# EAGLE design RaspiOmix (EAGLE 7.2.0)
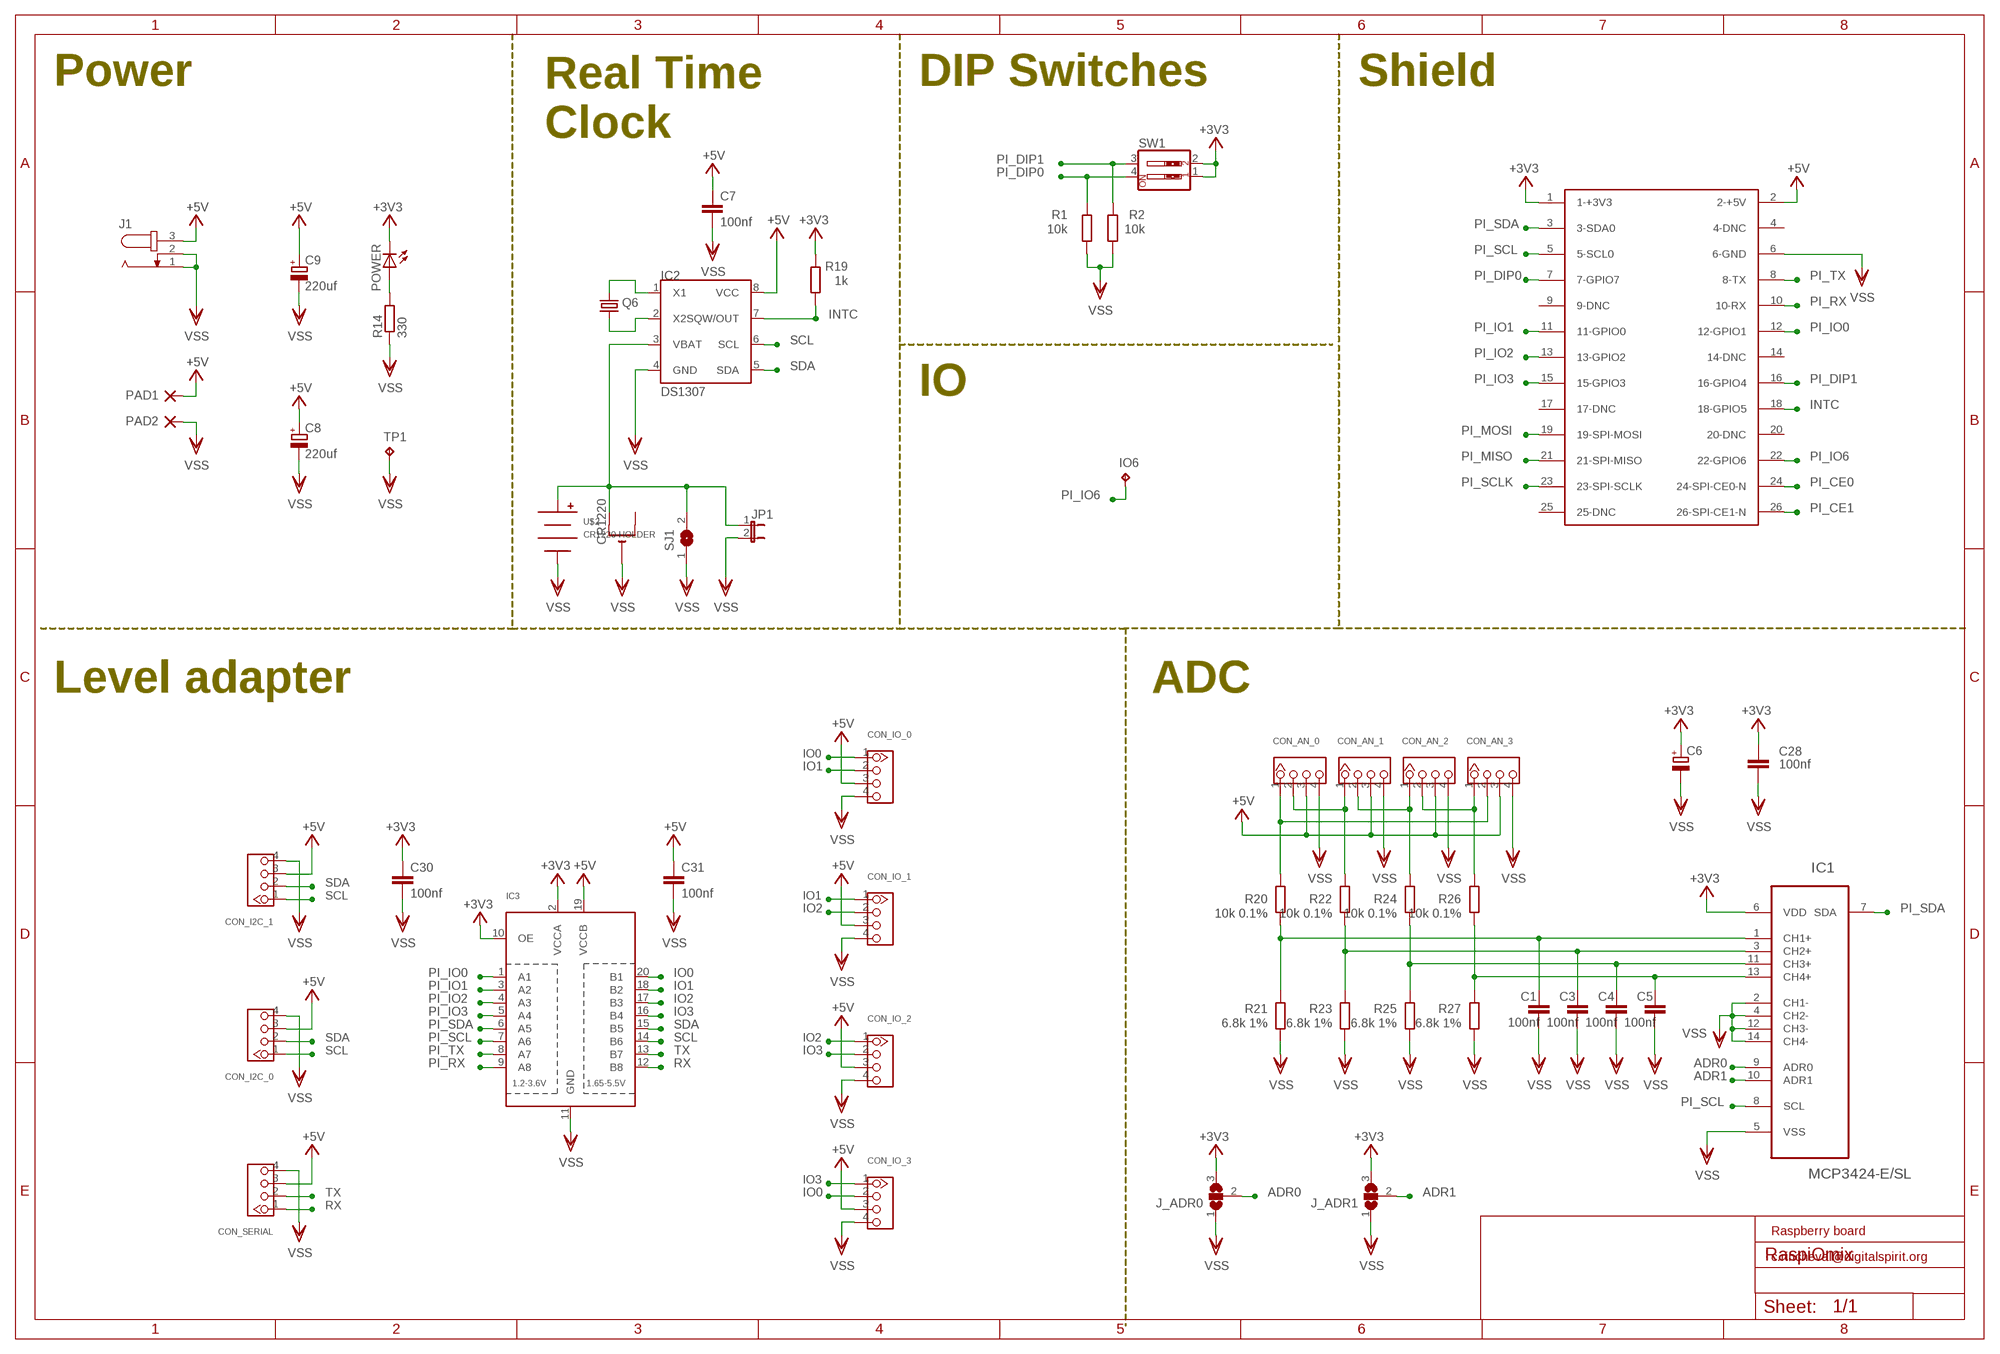
[diagram p0: schematic, sheet 1]

## Parts
C1  100nf  C-EUC0805  [C0805]
C3  100nf  C-EUC0805  [C0805]
C4  100nf  C-EUC0805  [C0805]
C5  100nf  C-EUC0805  [C0805]
C6  CPOL-EUB/3528-21R  [B/3528-21R]
C7  100nf  C-EUC0805  [C0805]
C8  220uf  CPOL-EUD  [PANASONIC_D]
C9  220uf  CPOL-EUD  [PANASONIC_D]
C28  100nf  C-EUC0805  [C0805]
C30  100nf  C-EUC0805  [C0805]
C31  100nf  C-EUC0805  [C0805]
CON_AN_0  TWIG-4P-2.0'90D'  [4P-2.0-90D]
CON_AN_1  TWIG-4P-2.0'90D'  [4P-2.0-90D]
CON_AN_2  TWIG-4P-2.0'90D'  [4P-2.0-90D]
CON_AN_3  TWIG-4P-2.0'90D'  [4P-2.0-90D]
CON_I2C_0  TWIG-4P-2.0'90D'  [4P-2.0-90D]
CON_I2C_1  TWIG-4P-2.0'90D'  [4P-2.0-90D]
CON_IO_0  TWIG-4P-2.0'90D'  [4P-2.0-90D]
CON_IO_1  TWIG-4P-2.0'90D'  [4P-2.0-90D]
CON_IO_2  TWIG-4P-2.0'90D'  [4P-2.0-90D]
CON_IO_3  TWIG-4P-2.0'90D'  [4P-2.0-90D]
CON_SERIAL  TWIG-4P-2.0'90D'  [4P-2.0-90D]
CR1220  CR1220THM  [CR1220-THM]
IC1  MCP3424-E/SL  [SOIC-14]
IC2  DS1307  [SOIC-8]
IC3  TXB0108PWR  [TSSOP20]
IO6  TPPAD1-13  [P1-13]
J1  JACK-PLUG0  [SPC4077]
J_ADR0  SJ2W  [SJ_2]
J_ADR1  SJ2W  [SJ_2]
JP1  JP1E  [JP1]
PAD1  WIREPAD3,17/1,3  [3,17/1,3]
PAD2  WIREPAD3,17/1,3  [3,17/1,3]
POWER  LEDCHIPLED_0805  [CHIPLED_0805]
Q6  CRYSTALTC26H  [TC26H]
R1  10k  R-EU_M0805  [M0805]
R2  10k  R-EU_M0805  [M0805]
R14  330  R-EU_M0805  [M0805]
R19  1k  R-EU_M0805  [M0805]
R20  10k 0.1%  R-EU_M0805  [M0805]
R21  6.8k 1%  R-EU_M0805  [M0805]
R22  10k 0.1%  R-EU_M0805  [M0805]
R23  6.8k 1%  R-EU_M0805  [M0805]
R24  10k 0.1%  R-EU_M0805  [M0805]
R25  6.8k 1%  R-EU_M0805  [M0805]
R26  10k 0.1%  R-EU_M0805  [M0805]
R27  6.8k 1%  R-EU_M0805  [M0805]
SJ1  SJ  [SJ]
SW1  SW_DIP-2  [EDG-02]
TP1  TPPAD1-13  [P1-13]
U$2  CR1220-HOLDER  [HARWIN-CR1220]
U$3  RASPBERRY-PILIGHT-HOLE  [RASPBERRY-PI-LIGHT-HOLE]

## Nets
+3V3: C6.+ C28.2 C30.1 IC1.6(VDD) IC3.2(VCCA) IC3.10(OE) J_ADR0.3 J_ADR1.3 POWER.C R19.2 SW1.1 SW1.2 U$3.1(1-+3V3)
+5V: C7.1 C8.+ C9.+ C31.1 CON_AN_0.3 CON_AN_1.3 CON_AN_2.3 CON_AN_3.3 CON_I2C_0.3 CON_I2C_1.3 CON_IO_0.3 CON_IO_1.3 CON_IO_2.3 CON_IO_3.3 CON_SERIAL.3 IC2.8(VCC) IC3.19(VCCB) J1.3 PAD1.1(P) U$3.2(2-+5V)
ADR0: IC1.9(ADR0) J_ADR0.2
ADR1: IC1.10(ADR1) J_ADR1.2
AN0: CON_AN_0.1 CON_AN_3.2 R20.2
AN1: CON_AN_0.2 CON_AN_1.1 R22.2
AN2: CON_AN_1.2 CON_AN_2.1 R24.2
AN3: CON_AN_2.2 CON_AN_3.1 R26.2
INTC: IC2.7(SQW/OUT) R19.1 U$3.18(18-GPIO5)
IO0: CON_IO_0.1 CON_IO_3.2 IC3.20(B1)
IO1: CON_IO_0.2 CON_IO_1.1 IC3.18(B2)
IO2: CON_IO_1.2 CON_IO_2.1 IC3.17(B3)
IO3: CON_IO_2.2 CON_IO_3.1 IC3.16(B4)
N$4: C5.1 IC1.13(CH4+) R26.1 R27.2
N$5: C4.1 IC1.11(CH3+) R24.1 R25.2
N$6: C3.1 IC1.3(CH2+) R22.1 R23.2
N$7: C1.1 IC1.1(CH1+) R20.1 R21.2
N$33: IC2.1(X1) Q6.1
N$34: IC2.2(X2) Q6.2
N$39: POWER.A R14.2
N$58: CR1220.+1(+) IC2.3(VBAT) JP1.1 SJ1.2 U$2.POS
PI_CE0: U$3.24(24-SPI-CE0-N)
PI_CE1: U$3.26(26-SPI-CE1-N)
PI_DIP0: R1.2 SW1.4 U$3.7(7-GPIO7)
PI_DIP1: R2.2 SW1.3 U$3.16(16-GPIO4)
PI_IO0: IC3.1(A1) U$3.12(12-GPIO1)
PI_IO1: IC3.3(A2) U$3.11(11-GPIO0)
PI_IO2: IC3.4(A3) U$3.13(13-GPIO2)
PI_IO3: IC3.5(A4) U$3.15(15-GPIO3)
PI_IO6: IO6.TP U$3.22(22-GPIO6)
PI_MISO: U$3.21(21-SPI-MISO)
PI_MOSI: U$3.19(19-SPI-MOSI)
PI_RX: IC3.9(A8) U$3.10(10-RX)
PI_SCL: IC1.8(SCL) IC3.7(A6) U$3.5(5-SCL0)
PI_SCLK: U$3.23(23-SPI-SCLK)
PI_SDA: IC1.7(SDA) IC3.6(A5) U$3.3(3-SDA0)
PI_TX: IC3.8(A7) U$3.8(8-TX)
RX: CON_SERIAL.1 IC3.12(B8)
SCL: CON_I2C_0.1 CON_I2C_1.1 IC2.6(SCL) IC3.14(B6)
SDA: CON_I2C_0.2 CON_I2C_1.2 IC2.5(SDA) IC3.15(B5)
TX: CON_SERIAL.2 IC3.13(B7)
VSS: C1.2 C3.2 C4.2 C5.2 C6.- C7.2 C8.- C9.- C28.1 C30.2 C31.2 CON_AN_0.4 CON_AN_1.4 CON_AN_2.4 CON_AN_3.4 CON_I2C_0.4 CON_I2C_1.4 CON_IO_0.4 CON_IO_1.4 CON_IO_2.4 CON_IO_3.4 CON_SERIAL.4 CR1220.- IC1.2(CH1-) IC1.4(CH2-) IC1.5(VSS) IC1.12(CH3-) IC1.14(CH4-) IC2.4(GND) IC3.11(GND) J1.1 J1.2 J_ADR0.1 J_ADR1.1 JP1.2 PAD2.1(P) R1.1 R2.1 R14.1 R21.1 R23.1 R25.1 R27.1 SJ1.1 TP1.TP U$2.NEG U$3.6(6-GND)
Unconnected: CR1220.+2(+1) U$3.4(4-DNC) U$3.9(9-DNC) U$3.14(14-DNC) U$3.17(17-DNC) U$3.20(20-DNC) U$3.25(25-DNC)

## Notes on the sheet
- Power | DIP Switches | Shield
- Real Time
  Clock
- IO
- Level adapter | ADC
- Raspberry board
- c.rincheval@digitalspirit.org

## Library data of the parts
C1 C3-C5 C7 C28 C30 C31 = rcl:C-EU: CAPACITOR, European symbol
C6 C8 C9 = rcl:CPOL-EU: POLARIZED CAPACITOR, European symbol
CON_AN_0 CON_AN_1-CON_AN_3 CON_I2C_0 CON_I2C_1 CON_IO_0 CON_IO_1-CON_IO_3 CON_SERIAL = Seeedstudio_Connector:TWIG-4P-2.0
CR1220 = adafruit:CR1220: CR1216/CR1220/CR1225 12mm 3V lithium coin cell Great for battery packup. Both SMT and THM holders. Note the THM package has the ground pads on both sides of the PCB so that the masks are the same - this reduces the cost
IC1 = eagleParts:MCP3424-E/SL
IC2 = eagleParts:DS1307: I2C Serial RTC w/56 bytes battery backed RAM
IC3 = adafruit:TXB0108PWR: 8-Bit Bi-Directional Level Shifter 1.2V-3.6V (VCCA) to 1.65V-5.5V (VCCB) bi-directional level shifter with auto direction sensing. Max data rate - VCCA 1.8V: 20Mbps (50ns), VCCA 3.3V: 100Mbps (10ns) Digikey: 296-21527-1-ND
IO6 TP1 = testpad:TP: Test pad
J1 = con-jack:JACK-PLUG: DC POWER JACK Power Jack, DC, Right Angle, Through Hole, Rated 5A at 16VDC, PC Terminals Distributor: Farnell (www.Farnell.de) Drawing: 84N1161.pdf / 84N1162.pdf Manufacturer: SPC Technology (www.spctechnology.com) Type: SPC4077 / SPC 4078; OC_FARNELL: unknown; OC_NEWARK: unknown
J_ADR0 J_ADR1 = jumper:SJ2W: SMD solder JUMPER
JP1 = jumper:JP1E: JUMPER
PAD1 PAD2 = wirepad:WIREPAD: Wire PAD connect wire on PCB
POWER = led:LED: LED OSRAM: - CHIPLED LG R971, LG N971, LY N971, LG Q971, LY Q971, LO R971, LY R971 LH N974, LH R974 LS Q976, LO Q976, LY Q976 LO Q996 - Hyper CHIPLED LW Q18S LB Q993, LB Q99A, LB R99A - SideLED LS A670, LO A670, LY A670, LG A670, LP A670 LB A673, LV A673, LT A673, LW A673 LH A674 LY A675 LS A676, LA A676, LO A676, LY A676, LW A676 LS A679, LY A679, LG A679 - Hyper Micro SIDELED® LS Y876, LA Y876, LO Y876, LY Y876 LT Y87S - SmartLED LW L88C, LW L88S LB L89C, LB L89S, LG L890 LS L89K, LO L89K, LY L89K LS L896, LA L896, LO L896, LY L896 - TOPLED LS T670, LO T670, LY T670, LG T670, LP T670 LSG T670, LSP T670, LSY T670, LOP T670, LYG T670 LG T671, LOG T671, LSG T671 LB T673, LV T673, LT T673, LW T673 LH T674 LS T676, LA T676, LO T676, LY T676, LB T676, LH T676, LSB T676, LW T676 LB T67C, LV T67C, LT T67C, LS T67K, LO T67K, LY T67K, LW E67C LS E67B, LA E67B, LO E67B, LY E67B, LB E67C, LV E67C, LT E67C LW T67C LS T679, LY T679, LG T679 LS T770, LO T770, LY T770, LG T770, LP T770 LB T773, LV T773, LT T773, LW T773 LH T774 LS E675, LA E675, LY E675, LS T675 LS T776, LA T776, LO T776, LY T776, LB T776 LHGB T686 LT T68C, LB T68C - Hyper Mini TOPLED® LB M676 - Mini TOPLED Santana® LG M470 LS M47K, LO M47K, LY M47K Source: http://www.osram.convergy.de LUXEON: - LUMILED® LXK2-PW12-R00, LXK2-PW12-S00, LXK2-PW14-U00, LXK2-PW14-V00 LXK2-PM12-R00, LXK2-PM12-S00, LXK2-PM14-U00 LXK2-PE12-Q00, LXK2-PE12-R00, LXK2-PE12-S00, LXK2-PE14-T00, LXK2-PE14-U00 LXK2-PB12-K00, LXK2-PB12-L00, LXK2-PB12-M00, LXK2-PB14-N00, LXK2-PB14-P00, LXK2-PB14-Q00 LXK2-PR12-L00, LXK2-PR12-M00, LXK2-PR14-Q00, LXK2-PR14-R00 LXK2-PD12-Q00, LXK2-PD12-R00, LXK2-PD12-S00 LXK2-PH12-R00, LXK2-PH12-S00 LXK2-PL12-P00, LXK2-PL12-Q00, LXK2-PL12-R00 Source: www.luxeon.com KINGBRIGHT: KA-3528ASYC Source: www.kingbright.com
Q6 = crystal:CRYSTAL: CRYSTAL; OC_FARNELL: unknown; OC_NEWARK: unknown
R1 R2 R14 R19-R27 = rcl:R-EU_: RESISTOR, European symbol
SJ1 = jumper:SJ: SMD solder JUMPER
SW1 = special:SW_DIP-2: DIP SWITCH
U$2 = battery-holder:CR1220-HOLDER
U$3 = RaspberryPi:RASPBERRY-PI: Raspberry Pi Board <http://www.raspberrypi.org/> Jacques Lagnel V1.0 (beta) 2012 Board dimension: Forum 3D model <http://www.raspberrypi.org/forum/general-discussion/mechanical-profile-3d-models?value=3d%20model&type=1&include=1&search=1&ret=all> The GPIO Connector (P1): http://elinux.org/RPi_Low-level_peripherals

## Board
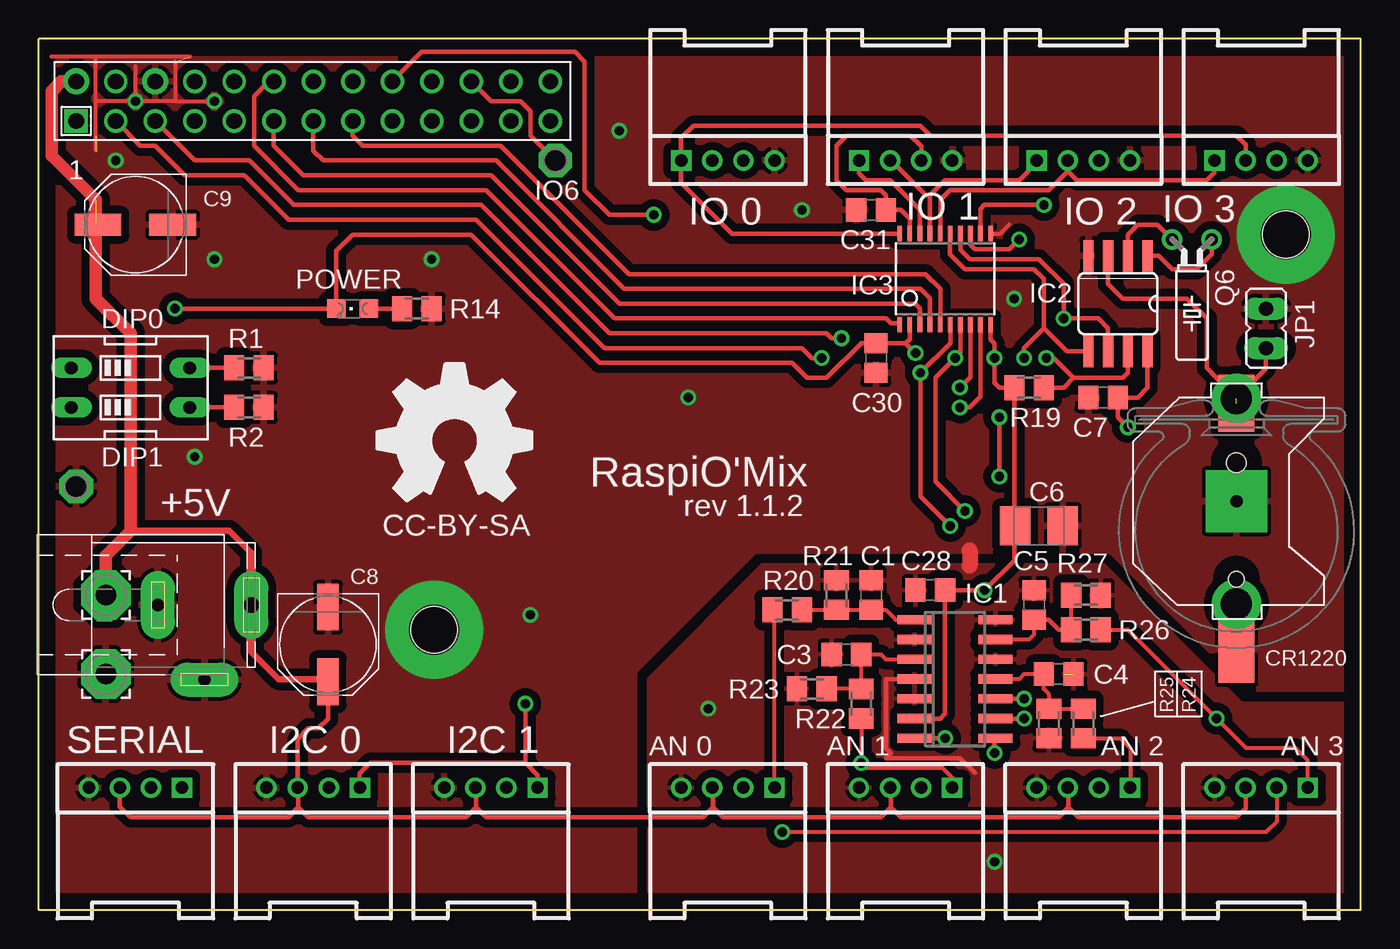
[diagram p1: board, top side]
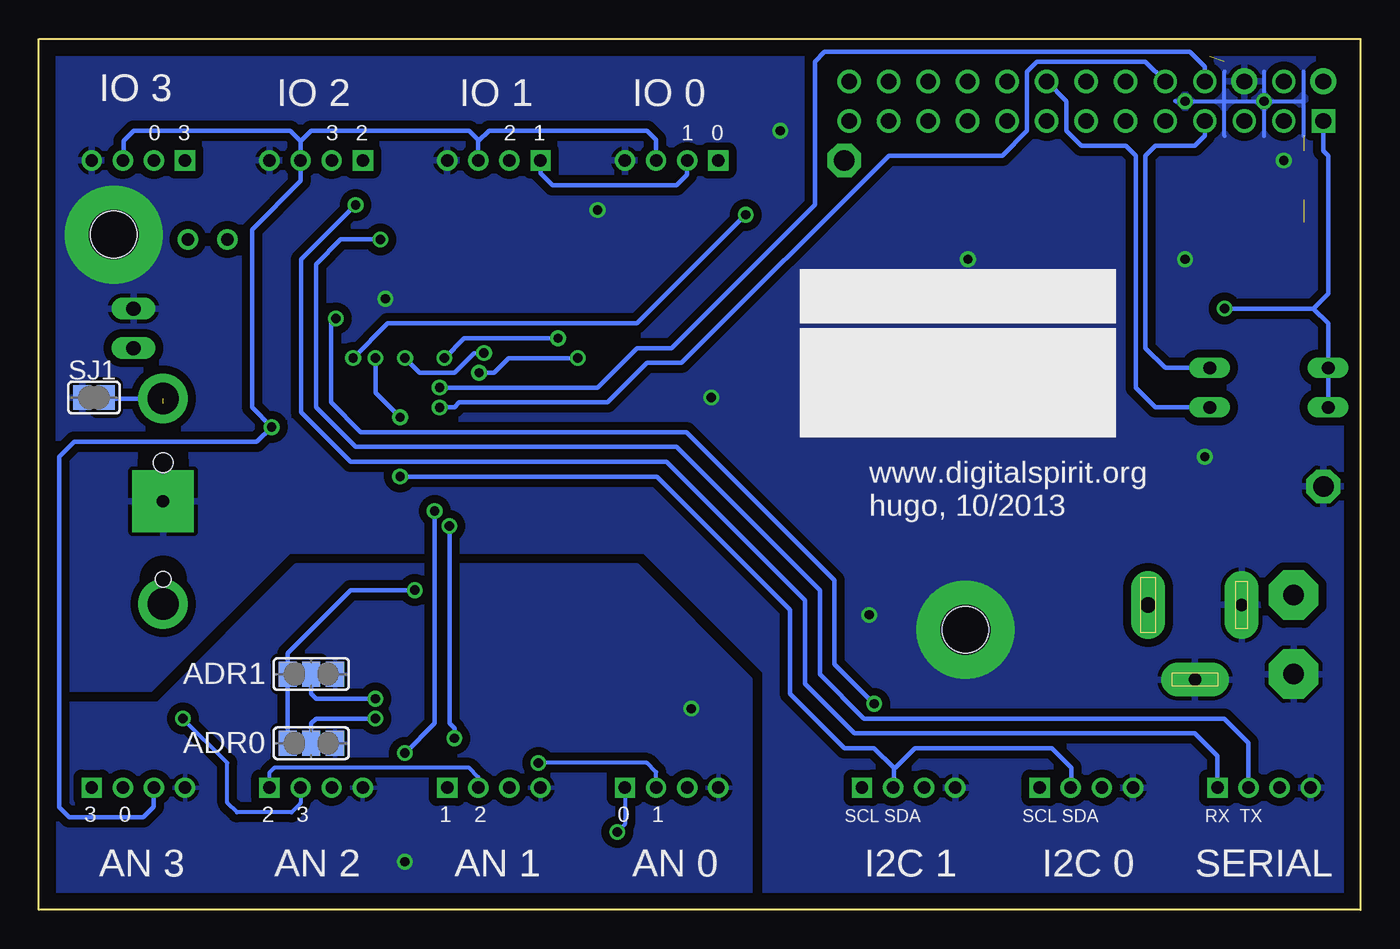
[diagram p2: board, bottom side, seen from below]

Size 85 x 56 mm. Coordinates in mm from the lower left corner, seen from the top.
Copper layers (1*16): Top 0.035mm / dielectric 1.5mm / Bottom 0.035mm
Design rules "default": minimum track width 10mil, minimum drill 24mil, track to track 8mil, track to pad 8mil, pad to pad 8mil, via to via 8mil, smd to smd 8mil, copper to edge 40mil, drill to drill 8mil, minimum pad ring 10mil, minimum via ring 8mil, stop-mask expansion 4mil, vias tented up to drill 0mil, thermal gap 10mil

### Footprints (pad centres in the part's own frame; a part is rotated, then mirrored left to right if it is on the bottom)
C0805 = smd 1.3 x 1.5: 1 -0.95,0; 2 0.95,0
B/3528-21R = smd 1.95 x 2.5: + 1.525,0; - -1.525,0
PANASONIC_D = smd 3 x 1.4: + 2.4,0; - -2.4,0
4P-2.0-90D = drill 0.8 pad 1.27 square: 1 -3,0 | drill 0.8 pad 1.27: 2 -1,0; 3 1,0; 4 3,0
CR1220-THM = drill 2 pad 3.175: +1 -6.604,0; +2 6.604,0 | drill 0.8 pad 3.962 square: - 0,0
SOIC-14 = smd 0.6 x 2.2: 1 -3.81,-2.6; 2 -2.54,-2.6; 3 -1.27,-2.6; 4 0,-2.6; 5 1.27,-2.6; 6 2.54,-2.6; 7 3.81,-2.6; 8 3.81,2.6; 9 2.54,2.6; 10 1.27,2.6; 11 0,2.6; 12 -1.27,2.6; 13 -2.54,2.6; 14 -3.81,2.6
SOIC-8 = smd 2.032 x 0.66: 1 -3.073,1.27; 2 -3.073,0; 3 -3.073,-1.27; 4 -3.073,-2.54; 5 3.073,-2.54; 6 3.073,-1.27; 7 3.073,0; 8 3.073,1.27
TSSOP20 = smd 0.305 x 0.991: 1 -2.925,-2.918; 2 -2.275,-2.918; 3 -1.625,-2.918; 4 -0.975,-2.918; 5 -0.325,-2.918; 6 0.325,-2.918; 7 0.975,-2.918; 8 1.625,-2.918; 9 2.275,-2.918; 10 2.925,-2.918; 11 2.925,2.918; 12 2.275,2.918; 13 1.625,2.918; 14 0.975,2.918; 15 0.325,2.918; 16 -0.325,2.918; 17 -0.975,2.918; 18 -1.625,2.918; 19 -2.275,2.918; 20 -2.925,2.918
P1-13 = drill 1.321 pad 2.159 octagon: TP 0,0
SPC4077 = drill 0.8 pad 2.184 long: 1 -3,0; 2 0,-4.8 | drill 1 pad 2.184 long: 3 3,0
SJ_2 = smd 1.168 x 1.6: 1 -1.524,0; 2 0,0; 3 1.524,0
JP1 = drill 0.914 long: 1 0,-1.27; 2 0,1.27
3,17/1,3 = drill 1.321 pad 3.175 octagon: 1 0,0
CHIPLED_0805 = smd 1.2 x 1.2: A 0,-1.05; C 0,1.05
TC26H = drill 0.813: 1 -1.27,0; 2 1.27,0
M0805 = smd 1.3 x 1.6: 1 -0.95,0; 2 0.95,0
SJ = smd 1.168 x 1.6: 1 -0.762,0; 2 0.762,0
EDG-02 = drill 0.813 long: 1 -1.27,-3.81; 2 1.27,-3.81; 3 1.27,3.81; 4 -1.27,3.81
HARWIN-CR1220 = smd 2.3 x 4.3: NEG 0,8.26 | smd 2.3 x 3.66: POS 0,-7.58 | hole 1: 0,3.75 | hole 1.25: 0,-3.75
RASPBERRY-PI-LIGHT-HOLE = drill 1 square: 1 -39.37,22.86 | drill 1 pad 1.676: 2 -39.37,25.4; 6 -34.29,25.4 | drill 1: 3 -36.83,22.86; 4 -36.83,25.4; 5 -34.29,22.86; 7 -31.75,22.86; 8 -31.75,25.4; 9 -29.21,22.86; 10 -29.21,25.4; 11 -26.67,22.86; 12 -26.67,25.4; 13 -24.13,22.86; 14 -24.13,25.4; 15 -21.59,22.86; 16 -21.59,25.4; 17 -19.05,22.86; 18 -19.05,25.4; 19 -16.51,22.86; 20 -16.51,25.4; 21 -13.97,22.86; 22 -13.97,25.4; 23 -11.43,22.86; 24 -11.43,25.4; 25 -8.89,22.86; 26 -8.89,25.4 | hole 3: -16.351,-9.842; 38.417,15.557

### Placement (x,y rotation side)
C1  53.52,20.24 90 top
C3  51.93,16.43 180 top
C4  65.58,15.16 0 top
C5  64,19.61 90 top
C6  64.31,24.69 180 top
C7  68.44,32.95 180 top
C8  18.59,17.07 270 top
C9  6.21,44.06 180 top
C28  57.33,20.56 0 top
C30  53.84,35.48 270 top
C31  53.52,45.01 180 top
CON_AN_0  44.31,7.86 180 top
CON_AN_1  55.74,7.86 180 top
CON_AN_2  67.17,7.86 180 top
CON_AN_3  78.6,7.86 180 top
CON_I2C_0  17.64,7.86 180 top
CON_I2C_1  29.07,7.86 180 top
CON_IO_0  44.31,48.18 0 top
CON_IO_1  55.74,48.18 0 top
CON_IO_2  67.17,48.18 0 top
CON_IO_3  78.6,48.18 0 top
CON_SERIAL  6.21,7.86 180 top
CR1220  77.01,26.28 270 top
IC1  58.92,14.85 270 top
IC2  70.03,38.98 270 top
IC3  58.28,40.56 0 top
IO6  33.2,48.18 0 top
J1  10.66,19.61 0 top
J_ADR0  67.49,10.72 180 bottom
J_ADR1  67.49,15.16 180 bottom
JP1  78.92,37.39 0 top
PAD1  4.31,20.24 0 top
PAD2  4.31,15.16 0 top
POWER  20.18,38.66 90 top
Q6  74.16,43.1 180 top
R1  13.51,34.85 180 top
R2  13.51,32.31 180 top
R14  24.31,38.66 180 top
R19  63.68,33.58 180 top
R20  48.12,19.29 180 top
R21  51.3,20.24 270 top
R22  52.88,13.26 270 top
R23  49.71,14.21 0 top
R24  67.17,11.99 270 top
R25  64.95,11.99 90 top
R26  67.33,18.02 0 top
R27  67.33,20.24 180 top
SJ1  81.46,32.95 0 bottom
SW1  5.89,33.58 270 top
TP1  2.4,27.23 0 top
U$1  [OSHW_FILLX350_NOTEXT]  21.77,26.28 0 top
U$2  77.01,25.01 180 top
U$3  41.77,27.86 0 top

### Tracks (layer width: path | path; a pad name or v marks a point on that pad's centre or on a via)
+3V3  (via drill 0.6, 0.6 pad 1.02)
  Top 0.254: C6.+ 62.73,24.69
  Top 0.305: v8.75,38.66 POWER.C 19.13,42.37 20.18,43.42 27.8,43.42 36.06,35.17 48.44,35.17 49.39,34.21 50.66,34.21 52.88,36.44 C30.1 55.74,36.43 55.74,36.44 | IC1.6 57.96,12.31 58.28,12.62 C28.2 v60.82,20.56 62.73,22.47 62.73,24.69 62.73,32.95 R19.2 61.77,33.58 61.46,33.9 v61.46,35.48 61.46,36.44 61.21,36.69 IC3.10 | IC3.2 56.01,36.7 55.74,36.44 | 55.74,36.44 v56.38,35.8
  Bottom 0.305: SW1.2 SW1.1 2.08,37.71 3.04,38.66 | v56.38,35.8 57.01,35.8 58.28,34.53 60.5,34.53 v61.46,35.48 | v8.75,38.66 3.04,38.66 | 3.04,38.66 2.08,39.61 2.08,48.5 2.4,48.82 U$3.1 | J_ADR0.3 J_ADR1.3 69.01,16.5 64.95,20.56 v60.82,20.56
+5V  (via drill 0.6 pad 1.02)  (1 unrouted)
  Top 0.305: IC2.8 71.3,35.58 71.3,33.58 70.66,32.95 C7.1 69.39,33.26 69.39,31.67 v70.03,31.04 | IC3.19 56.01,44.43 55.42,45.01 C31.1 | C31.1 | CON_SERIAL.3 5.21,6.64 5.89,5.96 16.05,5.96 16.69,6.59 | CON_AN_0.3 43.36,7.86 43.36,6.59 | 43.36,6.59 42.72,5.96 28.75,5.96 28.12,6.59 | 43.36,6.59 43.99,5.96 54.15,5.96 54.79,6.59 | 16.69,6.59 16.69,7.86 CON_I2C_0.3 16.64,10.99 17.32,11.67 17.96,11.67 18.59,12.31 18.59,14.53 18.45,14.67 18.22,14.67 | 16.69,6.59 17.32,5.96 27.48,5.96 28.12,6.59 | 28.12,6.59 28.12,7.81 CON_I2C_1.3 | CON_AN_1.3 54.79,7.81 54.79,6.59 | 54.79,6.59 55.42,5.96 65.58,5.96 66.22,6.59 | 66.22,6.59 66.22,7.81 CON_AN_2.3 | CON_AN_3.3 77.6,6.54 77.01,5.96 66.85,5.96 66.22,6.59 | C31.1 54.47,45.96 54.15,46.28 51.93,46.28 51.3,46.91 51.3,49.14 51.93,49.77 56.06,49.77 56.74,49.09 CON_IO_1.3
  Top 0.406: 5.89,24.37 12.24,24.37 13.66,22.96 J1.3 13.66,16.61 15.42,14.85 18.22,14.85 18.22,14.67 C8.+ 18.64,14.67
  Top 0.61: 3.67,44.2 C9.+ 3.67,43.92
  Top 0.813: PAD1.1 4.31,22.78 5.89,24.37 5.89,37.07 3.67,39.29 3.67,45.64 0.81,48.5 0.81,52.63 1.45,53.27 U$3.2
  Bottom 0.305: CON_IO_3.3 79.55,48.18 79.55,49.45 78.92,50.09 68.85,50.09 68.17,49.41 | CON_IO_0.3 45.31,49.5 45.9,50.09 56.06,50.09 56.74,49.41 CON_IO_1.3 56.74,49.5 57.33,50.09 67.49,50.09 68.17,49.41 | 68.17,49.41 CON_IO_2.3 68.17,46.87 71.3,43.74 71.3,32.31 v70.03,31.04 70.98,30.09 82.73,30.09 83.68,29.13 83.68,6.59 83.05,5.96 78.28,5.96 77.6,6.64 CON_AN_3.3 77.6,7.91
ADR0  (via drill 0.6 pad 1.02)
  Top 0.305: IC1.9 v63.36,12.31
  Bottom 0.102: J_ADR0.2 69.08,10.72
  Bottom 0.305: v63.36,12.31 67.17,12.31 67.49,11.99 J_ADR0.2
ADR1  (via drill 0.6 pad 1.02)
  Top 0.305: IC1.10 v63.36,13.58
  Bottom 0.102: J_ADR1.2 69.08,15.16
  Bottom 0.305: v63.36,13.58 67.17,13.58 67.49,13.89 J_ADR1.2
AN0  (via drill 0.6)
  Top 0.254: CON_AN_0.1 47.31,19.15 R20.2 | CON_AN_3.2 79.6,5.69 78.92,5 v47.8,5
  Bottom 0.254: CON_AN_0.1 47.31,5.5 v47.8,5
AN1  (via drill 0.6)
  Top 0.254: CON_AN_1.1 58.74,8.51 58.12,9.13 53.2,9.13 v52.88,9.45 R22.2
  Bottom 0.254: CON_AN_0.2 45.31,8.86 45.9,9.45 v52.88,9.45
AN2
  Top 0.254: R24.2 69.55,11.04 70.19,10.4 70.19,7.88 CON_AN_2.1
  Bottom 0.254: CON_AN_1.2 56.74,8.54 57.33,9.13 69.87,9.13 70.19,8.81 70.19,7.88 CON_AN_2.1
AN3  (via drill 0.6)
  Top 0.254: R26.2 70.03,18.02 v75.74,12.31 77.65,10.4 80.82,10.4 81.6,9.62 CON_AN_3.1
  Bottom 0.254: CON_AN_2.2 68.17,6.86 68.76,6.27 72.25,6.27 72.89,6.91 72.89,9.45 v75.74,12.31
INTC  (via drill 0.6, 0.6 pad 1.02)
  Top 0.305: U$3.18 24.63,55.17 34.47,55.17 35.1,54.53 35.1,46.28 36.69,44.69 v39.55,44.69 | IC2.7 70.03,34.53 69.71,34.21 66.53,34.21 | R19.1 65.9,33.58 66.53,34.21 | 66.53,34.21 65.27,35.48 v64.79,35.48
  Bottom 0.305: v39.55,44.69 46.53,37.71 62.57,37.71 v64.79,35.48
IO0
  Top 0.305: IC3.20 44.57,43.48 41.31,46.74 CON_IO_0.1 41.31,49.63 42.09,50.41 56.69,50.41 57.33,49.77 77.01,49.77 77.6,49.18 CON_IO_3.2
IO1
  Top 0.305: IC3.18 56.66,45.03 54.77,46.91 53.2,46.91 52.74,47.38 CON_IO_1.1
  Bottom 0.305: CON_IO_0.2 43.31,47.28 43.99,46.6 51.96,46.6 52.74,47.38 CON_IO_1.1
IO2
  Top 0.305: IC3.17 57.31,45.94 | 57.31,45.94 58.28,46.91 63.04,46.91 64.31,48.18 CON_IO_2.1 | CON_IO_1.2 54.79,48.18 57.03,45.94 57.31,45.94
IO3
  Top 0.305: IC3.16 57.96,43.49 57.96,45.64 58.6,46.28 64.95,46.28 66.17,47.5 | CON_IO_3.1 75.6,47.41 75.11,46.91 66.76,46.91 66.17,47.5 | CON_IO_2.2 66.17,47.5
N$4
  Top 0.254: R27.2 66.38,18.34 | 66.38,18.34 66.22,18.65 | 66.22,18.34 66.22,18.65 | 66.22,18.65 R26.1 66.38,18.34 | C5.1 64,17.7 63.68,17.39 IC1.13
  Top 0.305: C5.1 64.94,18.66 65.58,18.02 R26.1
N$5
  Top 0.254: IC1.11 63.04,14.85 63.36,15.16 C4.1 64.63,14.21 64.95,13.89 R25.2 R24.1
N$6
  Top 0.254: R23.2 R22.1 C3.1 54.15,16.43 54.47,16.12 IC1.3
N$7
  Top 0.254: R20.1 50.98,19.29 R21.2 C1.1 54.47,19.29 55.11,18.66 IC1.1
  Top 0.305: IC1.1 56.38,18.66 56.37,18.66
N$33
  Top 0.305: IC2.1 72.03,42.05 72.89,41.2 74.47,41.2 75.43,42.15 Q6.1
N$34
  Top 0.305: Q6.2 71.93,44.06 70.66,44.06 70.03,43.42 IC2.2
N$39
  Top 0.305: POWER.A R14.2
N$58  (1 unrouted)
  Top 0.305: IC2.3 68.76,40.25 69.71,39.29 73.84,39.29 75.11,38.02 75.11,34.85 CR1220.+1 78.92,34.79 JP1.1
  Bottom 0.305: CR1220.+1 80.63,32.88 SJ1.2
PI_DIP0
  Top 0.305: R1.2 SW1.4
  Bottom 0.305: SW1.4 R1.2 13.83,36.12 13.83,48.5 13.2,49.14 10.66,49.14 10.02,49.77 U$3.7
PI_DIP1
  Top 0.305: R2.2 SW1.3
  Bottom 0.305: U$3.16 18.91,51.99 18.91,50.09 17.96,49.14 15.1,49.14 14.47,48.5 14.47,33.58 13.2,32.31 SW1.3
PI_IO0
  Top 0.305: IC3.1 55.3,37.71 54.79,37.71 54.47,38.02 37.01,38.02 28.75,46.28 16.69,46.28 13.83,49.14 13.83,52.31 14.78,53.27 U$3.12
PI_IO1
  Top 0.305: U$3.11 15.1,49.14 17.01,47.23 29.07,47.23 37.33,38.98 56.38,38.98 56.65,38.7 56.65,37.72 IC3.3
PI_IO2
  Top 0.305: IC3.4 57.31,39.32 56.69,39.93 37.64,39.93 29.39,48.18 18.28,48.18 17.64,48.82 U$3.13
PI_IO3
  Top 0.305: U$3.15 20.18,49.77 20.82,49.14 29.71,49.14 37.96,40.88 57.01,40.88 57.96,39.93 57.96,37.65 IC3.5
PI_IO6
  Top 0.305: U$3.22 29.07,51.99 30.98,51.99 31.61,51.36 31.61,49.77 IO6.TP
PI_RX  (via drill 0.6)
  Top 0.305: IC3.9 60.56,33 59.87,32.31 v59.23,32.31
  Bottom 0.305: v59.23,32.31 58.28,32.31 57.96,32.63 48.44,32.63 45.9,35.17 43.68,35.17 30.34,48.5 23.04,48.5 21.45,50.09 21.45,53.9 20.82,54.53 13.83,54.53 U$3.10
PI_SCL  (via drill 0.6)
  Top 0.305: U$3.5 10.02,48.18 13.51,48.18 16.37,45.33 28.44,45.33 36.69,37.07 50.66,37.07 50.98,36.75 v51.61,36.75 | IC3.7 59.26,35.82 v58.92,35.48 57.65,34.21 57.65,27.55 v59.55,25.64 | IC1.8 61.46,11.04 v61.46,10.08
  Bottom 0.305: v61.46,10.08 59.55,11.99 v59.55,25.64 | v51.61,36.75 57.65,36.75 v58.92,35.48
PI_SDA  (via drill 0.6)
  Top 0.305: U$3.3 6.53,49.14 7.48,49.14 9.39,47.23 13.2,47.23 16.05,44.38 28.12,44.38 36.37,36.12 49.07,36.12 49.71,35.48 v50.34,35.48 | v58.6,24.69 56.69,26.59 v56.69,34.53 58.61,36.45 IC3.6 | IC1.7 v58.28,11.04
  Bottom 0.305: v58.6,24.69 58.6,11.99 58.28,11.67 v58.28,11.04 | v50.34,35.48 54.79,35.48 55.74,34.53 v56.69,34.53
PI_TX  (via drill 0.6)
  Top 0.305: IC3.8 59.91,34.25 v59.23,33.58
  Bottom 0.305: U$3.8 10.02,54.22 10.97,55.17 34.47,55.17 35.1,54.53 35.1,45.33 44.31,36.12 46.53,36.12 49.07,33.58 v59.23,33.58
RX  (via drill 0.6)
  Top 0.305: IC3.12 60.56,45.06 60.82,45.33 v64.63,45.33
  Bottom 0.305: v64.63,45.33 68.12,41.83 68.12,31.99 64.95,28.82 44.63,28.82 35.74,19.93 35.74,14.53 32.56,11.35 10.66,11.35 9.21,9.91 CON_SERIAL.1
SCL  (via drill 0.6)
  Top 0.305: IC3.14 59.26,42.45 59.87,41.83 64.31,41.83 65.9,40.25 v65.9,38.02 68.12,38.02 68.76,37.39 IC2.6 | CON_I2C_0.1 20.64,8.8 21.29,9.45 31.29,9.45 | CON_I2C_1.1 32.07,8.67 31.29,9.45 | 31.29,9.45 v31.29,13.26
  Bottom 0.305: v31.29,13.26 33.83,15.8 33.83,21.2 43.36,30.72 64.31,30.72 66.22,32.63 66.22,37.71 v65.9,38.02
SDA  (via drill 0.6 pad 1.02)
  Top 0.305: 64.63,37.39 64.63,40.56 64,41.2 59.55,41.2 58.6,42.15 58.6,43.47 IC3.15 | IC2.5 66.12,35.9 64.63,37.39 | 64.63,37.39 63.36,36.12 v63.36,35.48 | v61.77,31.67 v61.77,27.86
  Bottom 0.305: v61.77,27.86 45.26,27.86 36.69,19.29 36.69,13.89 33.2,10.4 31.29,10.4 30.02,9.13 | v63.36,35.48 63.36,33.26 v61.77,31.67 | CON_I2C_0.2 18.59,7.86 18.59,9.13 19.86,10.4 28.66,10.4 29.93,9.13 30.02,9.13 | CON_I2C_1.2 30.02,7.86 30.02,9.13
TX  (via drill 0.6 pad 1.02)
  Top 0.305: IC3.13 59.91,42.75 60.19,42.47 62.41,42.47 v63.04,43.1
  Bottom 0.305: v63.04,43.1 65.58,43.1 67.17,41.52 67.17,32.31 64.63,29.77 43.99,29.77 34.79,20.56 34.79,15.16 31.93,12.31 8.75,12.31 7.21,10.77 CON_SERIAL.2
VSS  (via drill 0.6, 3.2 pad 6.3)  (3 unrouted)
  Top 0.254: 6.21,54.22 v6.21,51.99 | 8.75,54.53 8.75,51.99 | 8.75,51.99 v11.29,51.99 | 3.67,48.82 3.67,51.99 | 3.67,51.99 3.67,54.85 | 8.75,51.99 v6.21,51.99 | v6.21,51.99 3.67,51.99 | 9.7,54.85 0.81,54.85 | IC3.11 61.83,43.48 62.41,44.06
  Top 0.305: IC1.4 54.47,14.85 54.47,10.4 54.79,10.08 54.47,9.77 59.23,9.77 60.19,8.81
  Top 1.016: 59.87,23.1 59.87,22.15
  Bottom 0.254: 11.93,51.99 v11.29,51.99 v6.21,51.99 | v6.21,51.99 3.67,51.99 | 6.21,49.77 v6.21,51.99 | v6.21,51.99 6.21,53.9 | 8.75,49.77 8.75,53.9 | 3.67,49.77 3.67,53.9
  other vias: 61.46,3.1 43.04,12.94 25.42,18.02 80.19,43.42 49.07,45.01 10.02,29.13 41.77,32.95 4.94,48.18 11.29,41.83 31.61,18.97 25.26,41.83 62.73,39.29 37.33,50.09
  pour Top (isolate 0.508): 0.5,55.17 0.5,0.56 38.28,0.56 38.28,15.32 46.06,23.1 68.92,23.1 77.81,14.21 84.63,14.21 84.63,55.17
  pour Bottom (isolate 0.508): 0.5,55.17 84.63,55.17 84.31,14.21 77.81,14.21 68.92,23.1 46.06,23.1 38.28,15.32 38.28,0.56 0.5,0.56
  pour Bottom (isolate 0.508): 39.23,0.56 84,0.56 84,13.26 77.33,13.26 68.44,22.15 46.53,22.15 39.23,14.85
  pour Top (isolate 0.508): 39.23,0.56 39.23,14.85 46.53,22.15 68.44,22.15 77.33,13.26 84,13.26 84,0.56

### Text on the board
bPlace: 0 | 1 | 1 | 2 | 2 | 3 | 3 | 0 | 1 | 0 | 2 | 1 | 3 | 2 | 0 | 3
tNames: IO 0 | IO 1 | IO 2 | IO 3 | DIP0 | DIP1 | RaspiO'Mix | +5V | rev 1.1.2 | CC-BY-SA | SERIAL | I2C 0 | I2C 1 | AN 0 | AN 1 | AN 2 | AN 3
bNames: IO 0 | IO 1 | IO 2 | IO 3 | www.digitalspirit.org / hugo, 10/2013 | ADR1 | ADR0 | TX | RX | SDA | SCL | SDA | SCL | SERIAL | I2C 0 | I2C 1 | AN 0 | AN 1 | AN 2 | AN 3